# EAGLE schematic SMP (EAGLE 9.4.2)

## Sheet 1 of 5
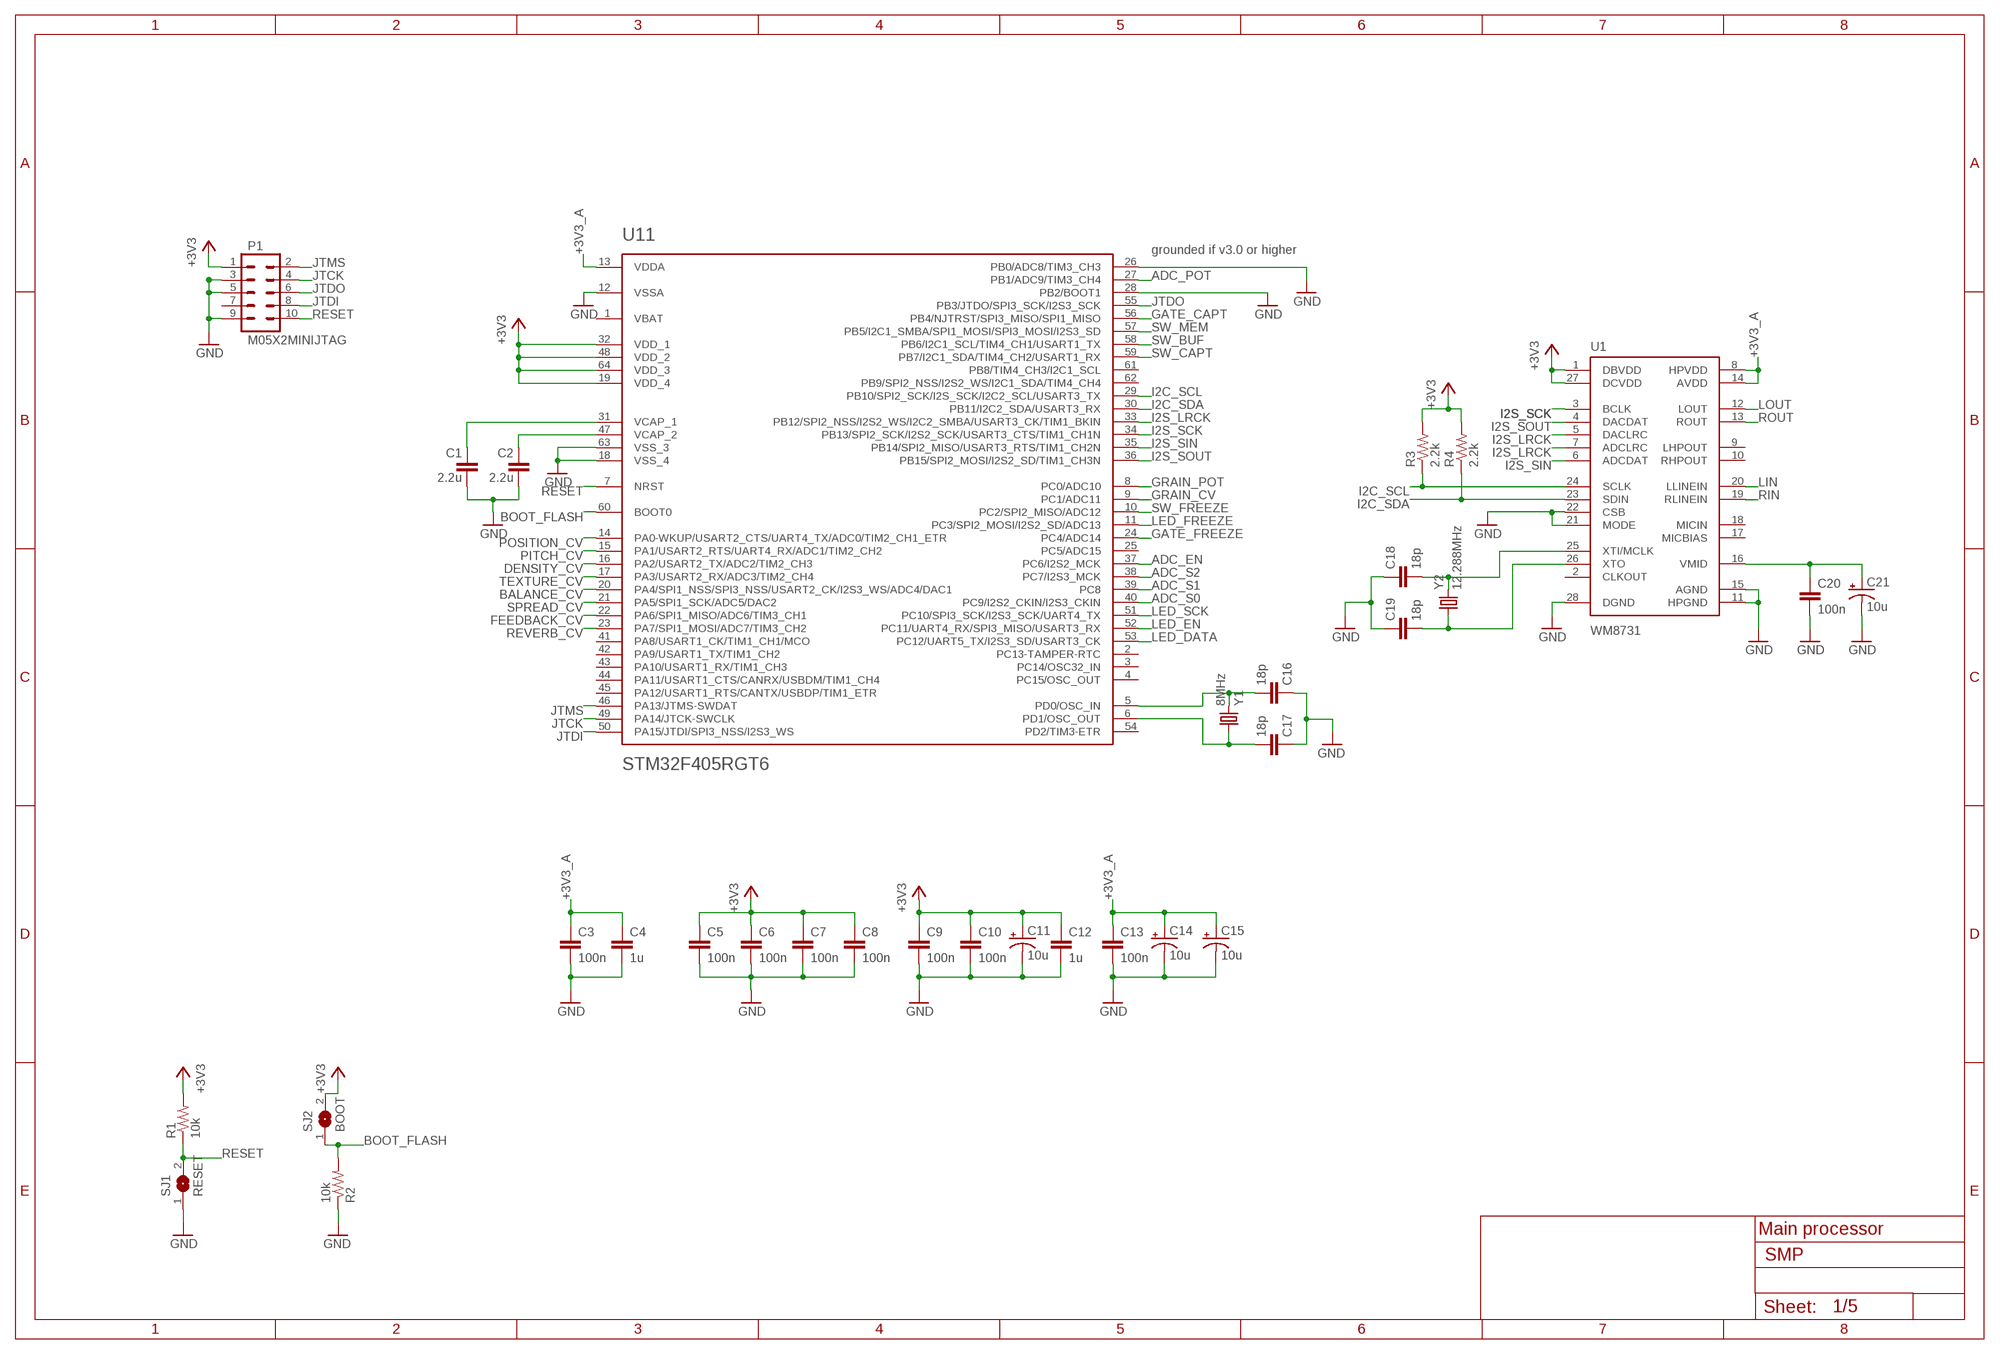
[diagram p0: schematic, sheet 1]

### Parts
C1  2.2u  C-EUC0603  [C0603]
C2  2.2u  C-EUC0603  [C0603]
C3  100n  C-EUC0603  [C0603]
C4  1u  C-EUC0603  [C0603]
C5  100n  C-EUC0603  [C0603]
C6  100n  C-EUC0603  [C0603]
C7  100n  C-EUC0603  [C0603]
C8  100n  C-EUC0603  [C0603]
C9  100n  C-EUC0603  [C0603]
C10  100n  C-EUC0603  [C0603]
C11  10u  CPOL-USA  [PANASONIC_A]
C12  1u  C-EUC0603  [C0603]
C13  100n  C-EUC0603  [C0603]
C14  10u  CPOL-USA  [PANASONIC_A]
C15  10u  CPOL-USB  [PANASONIC_B]
C16  18p  C-EUC0603  [C0603]
C17  18p  C-EUC0603  [C0603]
C18  18p  C-EUC0603  [C0603]
C19  18p  C-EUC0603  [C0603]
C20  100n  C-EUC0603  [C0603]
C21  10u  CPOL-USB  [PANASONIC_B]
P1  M05X2MINIJTAG  [2X5-1.27]
R1  10k  R-US_R0603  [R0603]
R2  10k  R-US_R0603  [R0603]
R3  2.2k  R-US_R0603  [R0603]
R4  2.2k  R-US_R0603  [R0603]
SJ1  RESET  SJ  [SJ]
SJ2  BOOT  SJ  [SJ]
U1  WM8731  [SSOP28]
U11  STM32F405RGT6  STM32F20X  [TQFP-10X10-64]
Y1  8MHz  CRYSTALHC49UP  [HC49UP]
Y2  12.288MHz  CRYSTALHC49UP  [HC49UP]

### Nets
+3V3 [width]: C5.1 C6.1 C7.1 C8.1 C9.1 C10.1 C11.+ C12.1 P1.1 R1.2 R3.2 R4.2 SJ2.2 U1.1(DBVDD) U1.27(DCVDD) U11.19(VDD_4) U11.32(VDD_1) U11.48(VDD_2) U11.64(VDD_3) ; also sheet 4,5
+3V3_A [width]: C3.1 C4.1 C13.1 C14.+ C15.+ U1.8(HPVDD) U1.14(AVDD) U11.13(VDDA) ; also sheet 3,4,5
ADC_EN: U11.37(PC6/I2S2_MCK) ; also sheet 4
ADC_POT: U11.27(PB1/ADC9/TIM3_CH4) ; also sheet 4
ADC_S0: U11.40(PC9/I2S2_CKIN/I2S3_CKIN) ; also sheet 4
ADC_S1: U11.39(PC8) ; also sheet 4
ADC_S2: U11.38(PC7/I2S3_MCK) ; also sheet 4
BALANCE_CV: U11.20(PA4/SPI1_NSS/SPI3_NSS/USART2_CK/I2S3_WS/ADC4/DAC1) ; also sheet 3
BOOT_FLASH: R2.2 SJ2.1 U11.60(BOOT0)
DENSITY_CV: U11.16(PA2/USART2_TX/ADC2/TIM2_CH3) ; also sheet 3
FEEDBACK_CV: U11.22(PA6/SPI1_MISO/ADC6/TIM3_CH1) ; also sheet 3
GATE_CAPT: U11.56(PB4/NJTRST/SPI3_MISO/SPI1_MISO) ; also sheet 4
GATE_FREEZE: U11.24(PC4/ADC14) ; also sheet 4
GND: C1.2 C2.2 C3.2 C4.2 C5.2 C6.2 C7.2 C8.2 C9.2 C10.2 C11.- C12.2 C13.2 C14.- C15.- C16.1 C17.1 C18.1 C19.1 C20.2 C21.- P1.3 P1.5 P1.9 R2.1 SJ1.1 U1.11(HPGND) U1.15(AGND) U1.21(MODE) U1.22(CSB) U1.28(DGND) U11.12(VSSA) U11.18(VSS_4) U11.26(PB0/ADC8/TIM3_CH3) U11.28(PB2/BOOT1) U11.63(VSS_3) ; also sheet 2,3,4,5
GRAIN_CV: U11.9(PC1/ADC11) ; also sheet 3
GRAIN_POT: U11.8(PC0/ADC10) ; also sheet 4
I2C_SCL: R3.1 U1.24(SCLK) U11.29(PB10/SPI2_SCK/I2S_SCK/I2C2_SCL/USART3_TX)
I2C_SDA: R4.1 U1.23(SDIN) U11.30(PB11/I2C2_SDA/USART3_RX)
I2S_LRCK: U1.5(DACLRC) U1.7(ADCLRC) U11.33(PB12/SPI2_NSS/I2S2_WS/I2C2_SMBA/USART3_CK/TIM1_BKIN)
I2S_SCK: U1.3(BCLK) U11.34(PB13/SPI2_SCK/I2S2_SCK/USART3_CTS/TIM1_CH1N)
I2S_SIN: U1.6(ADCDAT) U11.35(PB14/SPI2_MISO/USART3_RTS/TIM1_CH2N)
I2S_SOUT: U1.4(DACDAT) U11.36(PB15/SPI2_MOSI/I2S2_SD/TIM1_CH3N)
JTCK: P1.4 U11.49(PA14/JTCK-SWCLK)
JTDI: P1.8 U11.50(PA15/JTDI/SPI3_NSS/I2S3_WS)
JTDO: P1.6 U11.55(PB3/JTDO/SPI3_SCK/I2S3_SCK)
JTMS: P1.2 U11.46(PA13/JTMS-SWDAT)
LED_DATA: U11.53(PC12/UART5_TX/I2S3_SD/USART3_CK) ; also sheet 4
LED_EN: U11.52(PC11/UART4_RX/SPI3_MISO/USART3_RX) ; also sheet 4
LED_FREEZE: U11.11(PC3/SPI2_MOSI/I2S2_SD/ADC13) ; also sheet 4
LED_SCK: U11.51(PC10/SPI3_SCK/I2S3_SCK/UART4_TX) ; also sheet 4
LIN: U1.20(LLINEIN) ; also sheet 2
LOUT: U1.12(LOUT) ; also sheet 2
N$7: C16.2 U11.5(PD0/OSC_IN) Y1.2
N$8: C17.2 U11.6(PD1/OSC_OUT) Y1.1
N$13: C2.1 U11.47(VCAP_2)
N$17: C20.1 C21.+ U1.16(VMID)
N$19: C1.1 U11.31(VCAP_1)
N$59: C19.2 U1.26(XTO) Y2.1
N$60: C18.2 U1.25(XTI/MCLK) Y2.2
PITCH_CV: U11.15(PA1/USART2_RTS/UART4_RX/ADC1/TIM2_CH2) ; also sheet 3
POSITION_CV: U11.14(PA0-WKUP/USART2_CTS/UART4_TX/ADC0/TIM2_CH1_ETR) ; also sheet 3
RESET: P1.10 R1.1 SJ1.2 U11.7(NRST)
REVERB_CV: U11.23(PA7/SPI1_MOSI/ADC7/TIM3_CH2) ; also sheet 3
RIN: U1.19(RLINEIN) ; also sheet 2
ROUT: U1.13(ROUT) ; also sheet 2
SPREAD_CV: U11.21(PA5/SPI1_SCK/ADC5/DAC2) ; also sheet 3
SW_BUF: U11.58(PB6/I2C1_SCL/TIM4_CH1/USART1_TX) ; also sheet 4
SW_CAPT: U11.59(PB7/I2C1_SDA/TIM4_CH2/USART1_RX) ; also sheet 4
SW_FREEZE: U11.10(PC2/SPI2_MISO/ADC12) ; also sheet 4
SW_MEM: U11.57(PB5/I2C1_SMBA/SPI1_MOSI/SPI3_MOSI/I2S3_SD) ; also sheet 4
TEXTURE_CV: U11.17(PA3/USART2_RX/ADC3/TIM2_CH4) ; also sheet 3
Unconnected: P1.7 U1.2(CLKOUT) U1.9(LHPOUT) U1.10(RHPOUT) U1.17(MICBIAS) U1.18(MICIN) U11.2(PC13-TAMPER-RTC) U11.3(PC14/OSC32_IN) U11.4(PC15/OSC_OUT) U11.25(PC5/ADC15) U11.41(PA8/USART1_CK/TIM1_CH1/MCO) U11.42(PA9/USART1_TX/TIM1_CH2) U11.43(PA10/USART1_RX/TIM1_CH3) U11.44(PA11/USART1_CTS/CANRX/USBDM/TIM1_CH4) U11.45(PA12/USART1_RTS/CANTX/USBDP/TIM1_ETR) U11.54(PD2/TIM3-ETR) U11.61(PB8/TIM4_CH3/I2C1_SCL) U11.62(PB9/SPI2_NSS/I2S2_WS/I2C1_SDA/TIM4_CH4)

### Notes on the sheet
- grounded if v3.0 or higher
- Main processor

## Sheet 2 of 5
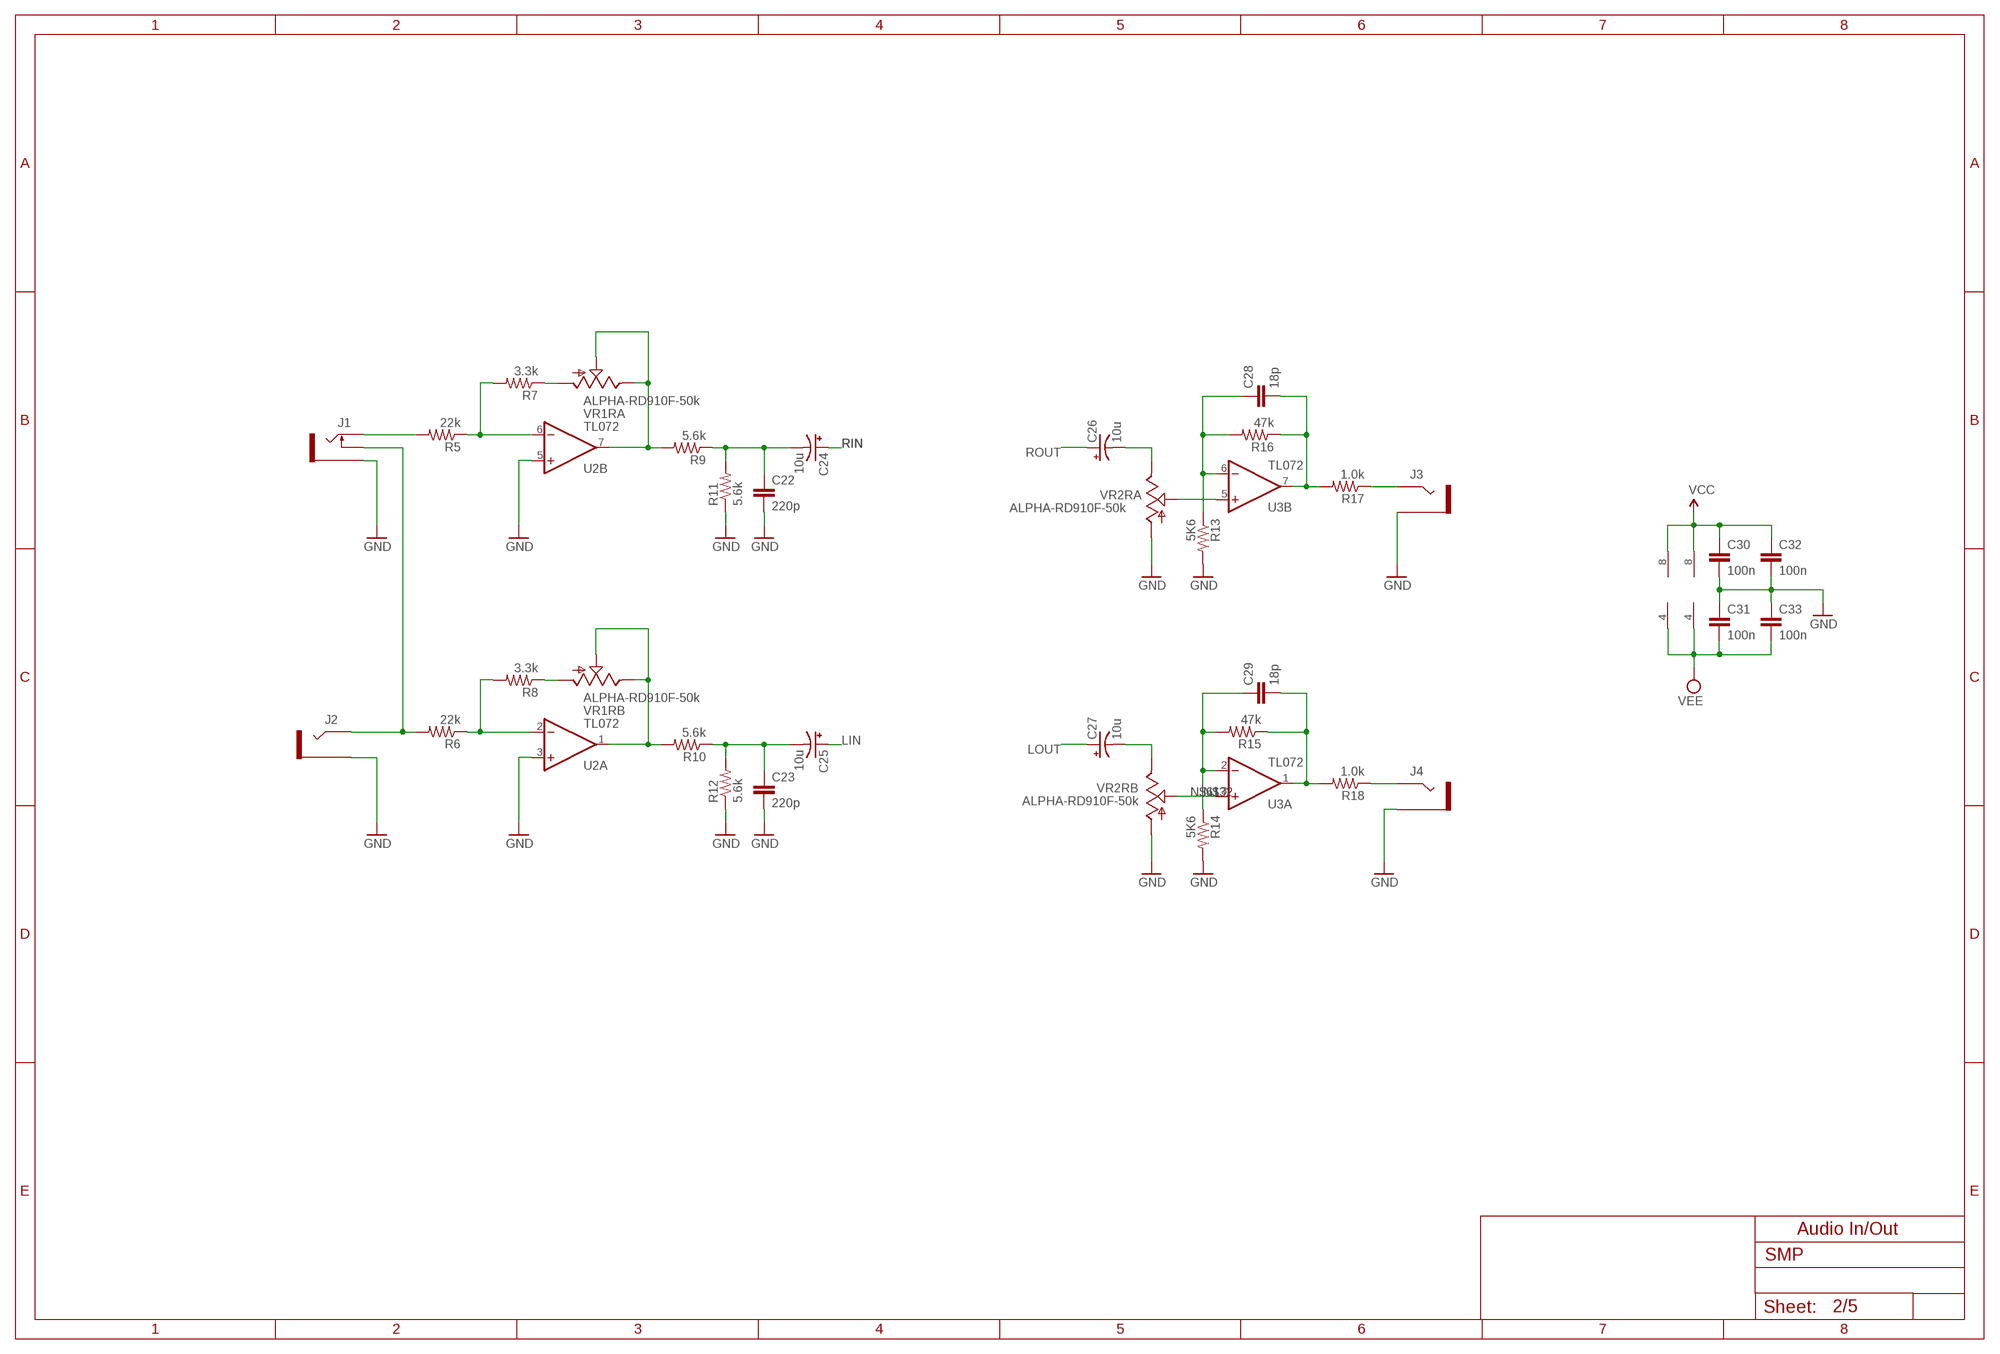
[diagram p1: schematic, sheet 2]

### Parts
C22  220p  C-EUC0603  [C0603]
C23  220p  C-EUC0603  [C0603]
C24  10u  CPOL-USB  [PANASONIC_B]
C25  10u  CPOL-USB  [PANASONIC_B]
C26  10u  CPOL-USB  [PANASONIC_B]
C27  10u  CPOL-USB  [PANASONIC_B]
C28  18p  C-EUC0603  [C0603]
C29  18p  C-EUC0603  [C0603]
C30  100n  C-EUC0603  [C0603]
C31  100n  C-EUC0603  [C0603]
C32  100n  C-EUC0603  [C0603]
C33  100n  C-EUC0603  [C0603]
J1  SWITCHCRAFT_42A  [SWITCH_JOHNSON]
J2  SWITCHCRAFT_JACK  [SWITCH]
J3  SWITCHCRAFT_JACK  [SWITCH]
J4  SWITCHCRAFT_JACK  [SWITCH]
R5  22k  R-US_R0603  [R0603]
R6  22k  R-US_R0603  [R0603]
R7  3.3k  R-US_R0603  [R0603]
R8  3.3k  R-US_R0603  [R0603]
R9  5.6k  R-US_R0603  [R0603]
R10  5.6k  R-US_R0603  [R0603]
R11  5.6k  R-US_R0603  [R0603]
R12  5.6k  R-US_R0603  [R0603]
R13  5K6  R-US_R0603  [R0603]
R14  5K6  R-US_R0603  [R0603]
R15  47k  R-US_R0603  [R0603]
R16  47k  R-US_R0603  [R0603]
R17  1.0k  R-US_R0603  [R0603]
R18  1.0k  R-US_R0603  [R0603]
U2  TL072  DUAL_OPAMPD  [SO08]
U3  TL072  DUAL_OPAMPD  [SO08]
VR1  ALPHA-RD910F-50k  POT_US_DUAL_GANGALPHA  [ALPHA902F]
VR2  ALPHA-RD910F-50k  POT_US_DUAL_GANGALPHA  [ALPHA902F]

### Nets
GND: C22.2 C23.2 C30.2 C31.1 C32.2 C33.1 J1.G J2.G J3.G J4.G R11.1 R12.1 R13.2 R14.2 U2.3(A:+IN) U2.5(B:+IN) VR2.1R1 VR2.1R2 ; also sheet 1,3,4,5
LIN: C25.+ ; also sheet 1
LOUT: C27.+ ; also sheet 1
LOUT_JACK: J4.S R18.1
N$3: C26.- VR2.3R1
N$18: C23.1 C25.- R10.1 R12.2
N$20: J1.S R5.2
N$21: J1.C J2.S R6.2
N$22: C22.1 C24.- R9.1 R11.2
N$23: C27.- VR2.3R2
N$25: C28.1 R13.1 R16.2 U3.6(B:-IN)
N$28: C28.2 R16.1 R17.2 U3.7(B:OUT)
N$31: U3.5(B:+IN) VR2.2R1
N$32: C29.1 R14.1 R15.2 U3.2(A:-IN)
N$33: C29.2 R15.1 R18.2 U3.1(A:OUT)
N$42: R9.2 U2.7(B:OUT) VR1.2R1 VR1.3R1
N$51: R10.2 U2.1(A:OUT) VR1.2R2 VR1.3R2
N$52: R7.1 VR1.1R1
N$53: R8.1 VR1.1R2
N$54: R5.1 R7.2 U2.6(B:-IN)
N$58: R6.1 R8.2 U2.2(A:-IN)
N$61: U3.3(A:+IN) VR2.2R2
RIN: C24.+ ; also sheet 1
ROUT: C26.+ ; also sheet 1
ROUT_JACK: J3.S R17.1
VCC [width]: C30.1 C32.1 U2.8(P:V+) U3.8(P:V+) ; also sheet 3,5
VEE [width]: C31.2 C33.2 U2.4(P:V-) U3.4(P:V-) ; also sheet 3,5

### Notes on the sheet
- Audio In/Out

## Sheet 3 of 5
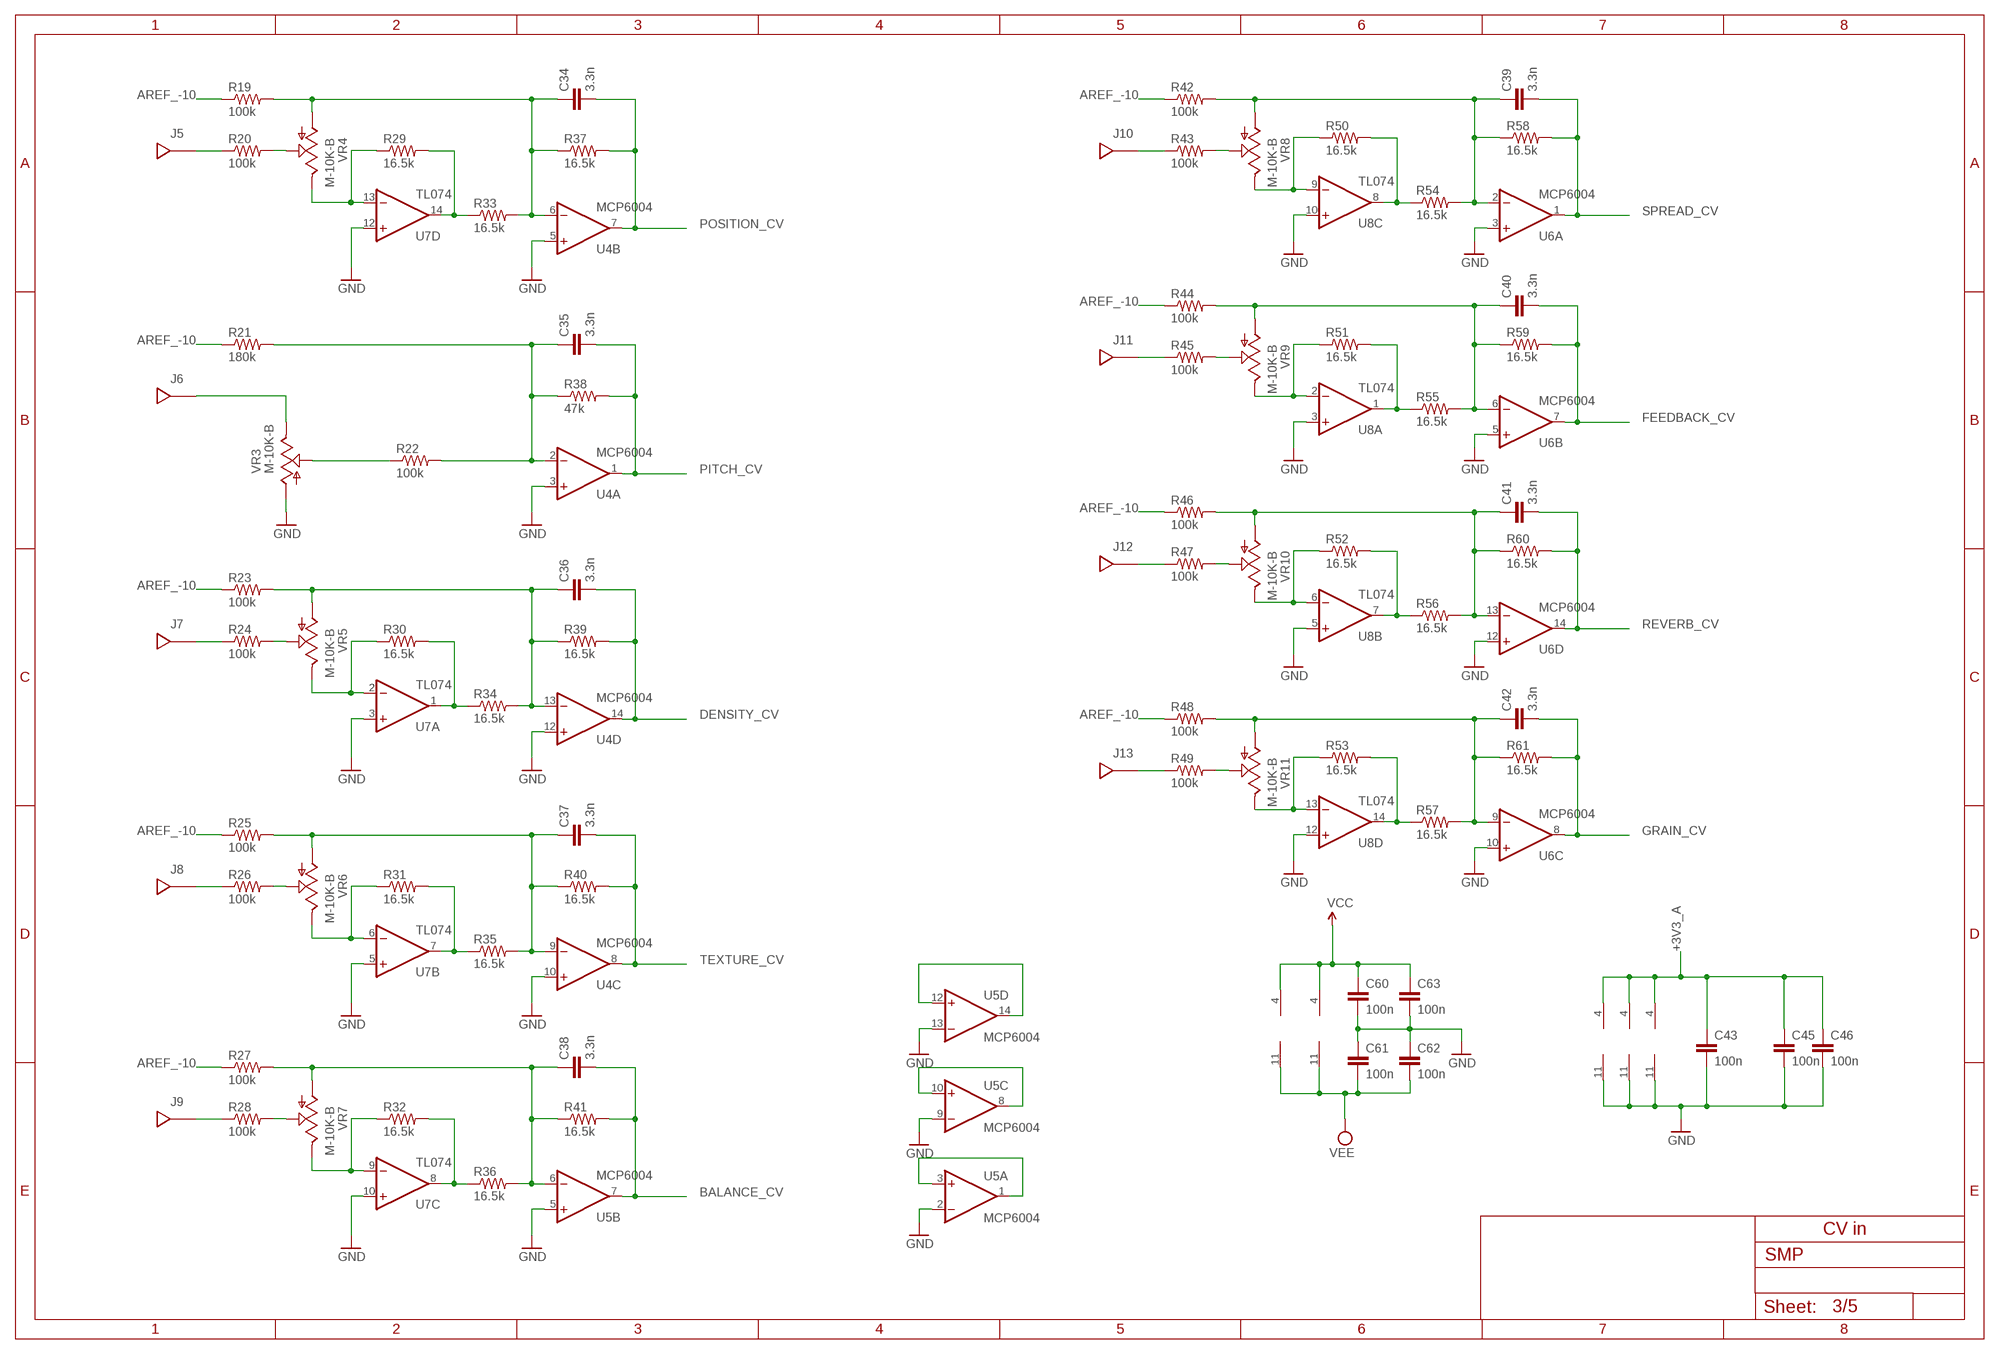
[diagram p2: schematic, sheet 3]

### Parts
C34  3.3n  C-EUC0603  [C0603]
C35  3.3n  C-EUC0603  [C0603]
C36  3.3n  C-EUC0603  [C0603]
C37  3.3n  C-EUC0603  [C0603]
C38  3.3n  C-EUC0603  [C0603]
C39  3.3n  C-EUC0603  [C0603]
C40  3.3n  C-EUC0603  [C0603]
C41  3.3n  C-EUC0603  [C0603]
C42  3.3n  C-EUC0603  [C0603]
C43  100n  C-EUC0603  [C0603]
C45  100n  C-EUC0603  [C0603]
C46  100n  C-EUC0603  [C0603]
C60  100n  C-EUC0603  [C0603]
C61  100n  C-EUC0603  [C0603]
C62  100n  C-EUC0603  [C0603]
C63  100n  C-EUC0603  [C0603]
J5  JOHNSON_BANANASTD  [JOHNSON]
J6  JOHNSON_BANANASTD  [JOHNSON]
J7  JOHNSON_BANANASTD  [JOHNSON]
J8  JOHNSON_BANANASTD  [JOHNSON]
J9  JOHNSON_BANANASTD  [JOHNSON]
J10  JOHNSON_BANANASTD  [JOHNSON]
J11  JOHNSON_BANANASTD  [JOHNSON]
J12  JOHNSON_BANANASTD  [JOHNSON]
J13  JOHNSON_BANANASTD  [JOHNSON]
R19  100k  R-US_R0603  [R0603]
R20  100k  R-US_R0603  [R0603]
R21  180k  R-US_R0603  [R0603]
R22  100k  R-US_R0603  [R0603]
R23  100k  R-US_R0603  [R0603]
R24  100k  R-US_R0603  [R0603]
R25  100k  R-US_R0603  [R0603]
R26  100k  R-US_R0603  [R0603]
R27  100k  R-US_R0603  [R0603]
R28  100k  R-US_R0603  [R0603]
R29  16.5k  R-US_R0603  [R0603]
R30  16.5k  R-US_R0603  [R0603]
R31  16.5k  R-US_R0603  [R0603]
R32  16.5k  R-US_R0603  [R0603]
R33  16.5k  R-US_R0603  [R0603]
R34  16.5k  R-US_R0603  [R0603]
R35  16.5k  R-US_R0603  [R0603]
R36  16.5k  R-US_R0603  [R0603]
R37  16.5k  R-US_R0603  [R0603]
R38  47k  R-US_R0603  [R0603]
R39  16.5k  R-US_R0603  [R0603]
R40  16.5k  R-US_R0603  [R0603]
R41  16.5k  R-US_R0603  [R0603]
R42  100k  R-US_R0603  [R0603]
R43  100k  R-US_R0603  [R0603]
R44  100k  R-US_R0603  [R0603]
R45  100k  R-US_R0603  [R0603]
R46  100k  R-US_R0603  [R0603]
R47  100k  R-US_R0603  [R0603]
R48  100k  R-US_R0603  [R0603]
R49  100k  R-US_R0603  [R0603]
R50  16.5k  R-US_R0603  [R0603]
R51  16.5k  R-US_R0603  [R0603]
R52  16.5k  R-US_R0603  [R0603]
R53  16.5k  R-US_R0603  [R0603]
R54  16.5k  R-US_R0603  [R0603]
R55  16.5k  R-US_R0603  [R0603]
R56  16.5k  R-US_R0603  [R0603]
R57  16.5k  R-US_R0603  [R0603]
R58  16.5k  R-US_R0603  [R0603]
R59  16.5k  R-US_R0603  [R0603]
R60  16.5k  R-US_R0603  [R0603]
R61  16.5k  R-US_R0603  [R0603]
U4  MCP6004  QUAD_OPAMPD  [SO14]
U5  MCP6004  QUAD_OPAMPD  [SO14]
U6  MCP6004  QUAD_OPAMPD  [SO14]
U7  TL074  QUAD_OPAMPD  [SO14]
U8  TL074  QUAD_OPAMPD  [SO14]
VR3  M-10K-B  POT_USRD901F  [ALPHA901F]
VR4  M-10K-B  POT_USRD901F  [ALPHA901F]
VR5  M-10K-B  POT_USRD901F  [ALPHA901F]
VR6  M-10K-B  POT_USRD901F  [ALPHA901F]
VR7  M-10K-B  POT_USRD901F  [ALPHA901F]
VR8  M-10K-B  POT_USRD901F  [ALPHA901F]
VR9  M-10K-B  POT_USRD901F  [ALPHA901F]
VR10  M-10K-B  POT_USRD901F  [ALPHA901F]
VR11  M-10K-B  POT_USRD901F  [ALPHA901F]

### Nets
+3V3_A [width]: C43.1 C45.1 C46.1 U4.4(P:V+) U5.4(P:V+) U6.4(P:V+) ; also sheet 1,4,5
AREF_-10 [width]: R19.1 R21.1 R23.1 R25.1 R27.1 R42.1 R44.1 R46.1 R48.1 ; also sheet 5
BALANCE_CV: C38.2 R41.2 U5.7(B:OUT) ; also sheet 1
DENSITY_CV: C36.2 R39.2 U4.14(D:OUT) ; also sheet 1
FEEDBACK_CV: C40.2 R59.2 U6.7(B:OUT) ; also sheet 1
GND: C43.2 C45.2 C46.2 C60.2 C61.1 C62.1 C63.2 U4.3(A:+IN) U4.5(B:+IN) U4.10(C:+IN) U4.11(P:V-) U4.12(D:+IN) U5.2(A:-IN) U5.5(B:+IN) U5.9(C:-IN) U5.11(P:V-) U5.13(D:-IN) U6.3(A:+IN) U6.5(B:+IN) U6.10(C:+IN) U6.11(P:V-) U6.12(D:+IN) U7.3(A:+IN) U7.5(B:+IN) U7.10(C:+IN) U7.12(D:+IN) U8.3(A:+IN) U8.5(B:+IN) U8.10(C:+IN) U8.12(D:+IN) VR3.1 ; also sheet 1,2,4,5
GRAIN_CV: C42.2 R61.2 U6.8(C:OUT) ; also sheet 1
N$1: J7.1 R24.1
N$2: R43.2 VR8.2
N$4: C36.1 R23.2 R34.2 R39.1 U4.13(D:-IN) VR5.1
N$5: R30.1 U7.2(A:-IN) VR5.3
N$6: R30.2 R34.1 U7.1(A:OUT)
N$10: J8.1 R26.1
N$11: R47.2 VR10.2
N$14: C37.1 R25.2 R35.2 R40.1 U4.9(C:-IN) VR6.1
N$15: R31.1 U7.6(B:-IN) VR6.3
N$24: R31.2 R35.1 U7.7(B:OUT)
N$26: J9.1 R28.1
N$27: R49.2 VR11.2
N$30: C38.1 R27.2 R36.2 R41.1 U5.6(B:-IN) VR7.1
N$35: R32.1 U7.9(C:-IN) VR7.3
N$56 [width]: J6.1 VR3.3
N$62: R32.2 R36.1 U7.8(C:OUT)
N$63: J5.1 R20.1
N$64: J10.1 R43.1
N$73: R28.2 VR7.2
N$81: U5.12(D:+IN) U5.14(D:OUT)
N$82: C34.1 R19.2 R33.2 R37.1 U4.6(B:-IN) VR4.1
N$83: R22.1 VR3.2
N$84: R29.1 U7.13(D:-IN) VR4.3
N$85: R29.2 R33.1 U7.14(D:OUT)
N$86: R26.2 VR6.2
N$87: C35.1 R21.2 R22.2 R38.1 U4.2(A:-IN)
N$90: J11.1 R45.1
N$91: R24.2 VR5.2
N$92: C39.1 R42.2 R54.2 R58.1 U6.2(A:-IN) VR8.1
N$93: R50.1 U8.9(C:-IN) VR8.3
N$94: R50.2 R54.1 U8.8(C:OUT)
N$95: J12.1 R47.1
N$96: R45.2 VR9.2
N$97: C40.1 R44.2 R55.2 R59.1 U6.6(B:-IN) VR9.1
N$98: R51.1 U8.2(A:-IN) VR9.3
N$99: R51.2 R55.1 U8.1(A:OUT)
N$101: U5.8(C:OUT) U5.10(C:+IN)
N$102: C41.1 R46.2 R56.2 R60.1 U6.13(D:-IN) VR10.1
N$103: R52.1 U8.6(B:-IN) VR10.3
N$104: R52.2 R56.1 U8.7(B:OUT)
N$105: J13.1 R49.1
N$106: R20.2 VR4.2
N$107: C42.1 R48.2 R57.2 R61.1 U6.9(C:-IN) VR11.1
N$108: R53.1 U8.13(D:-IN) VR11.3
N$109: R53.2 R57.1 U8.14(D:OUT)
N$111: U5.1(A:OUT) U5.3(A:+IN)
PITCH_CV: C35.2 R38.2 U4.1(A:OUT) ; also sheet 1
POSITION_CV: C34.2 R37.2 U4.7(B:OUT) ; also sheet 1
REVERB_CV: C41.2 R60.2 U6.14(D:OUT) ; also sheet 1
SPREAD_CV: C39.2 R58.2 U6.1(A:OUT) ; also sheet 1
TEXTURE_CV: C37.2 R40.2 U4.8(C:OUT) ; also sheet 1
VCC [width]: C60.1 C63.1 U7.4(P:V+) U8.4(P:V+) ; also sheet 2,5
VEE [width]: C61.2 C62.2 U7.11(P:V-) U8.11(P:V-) ; also sheet 2,5

### Notes on the sheet
- CV in

## Sheet 4 of 5
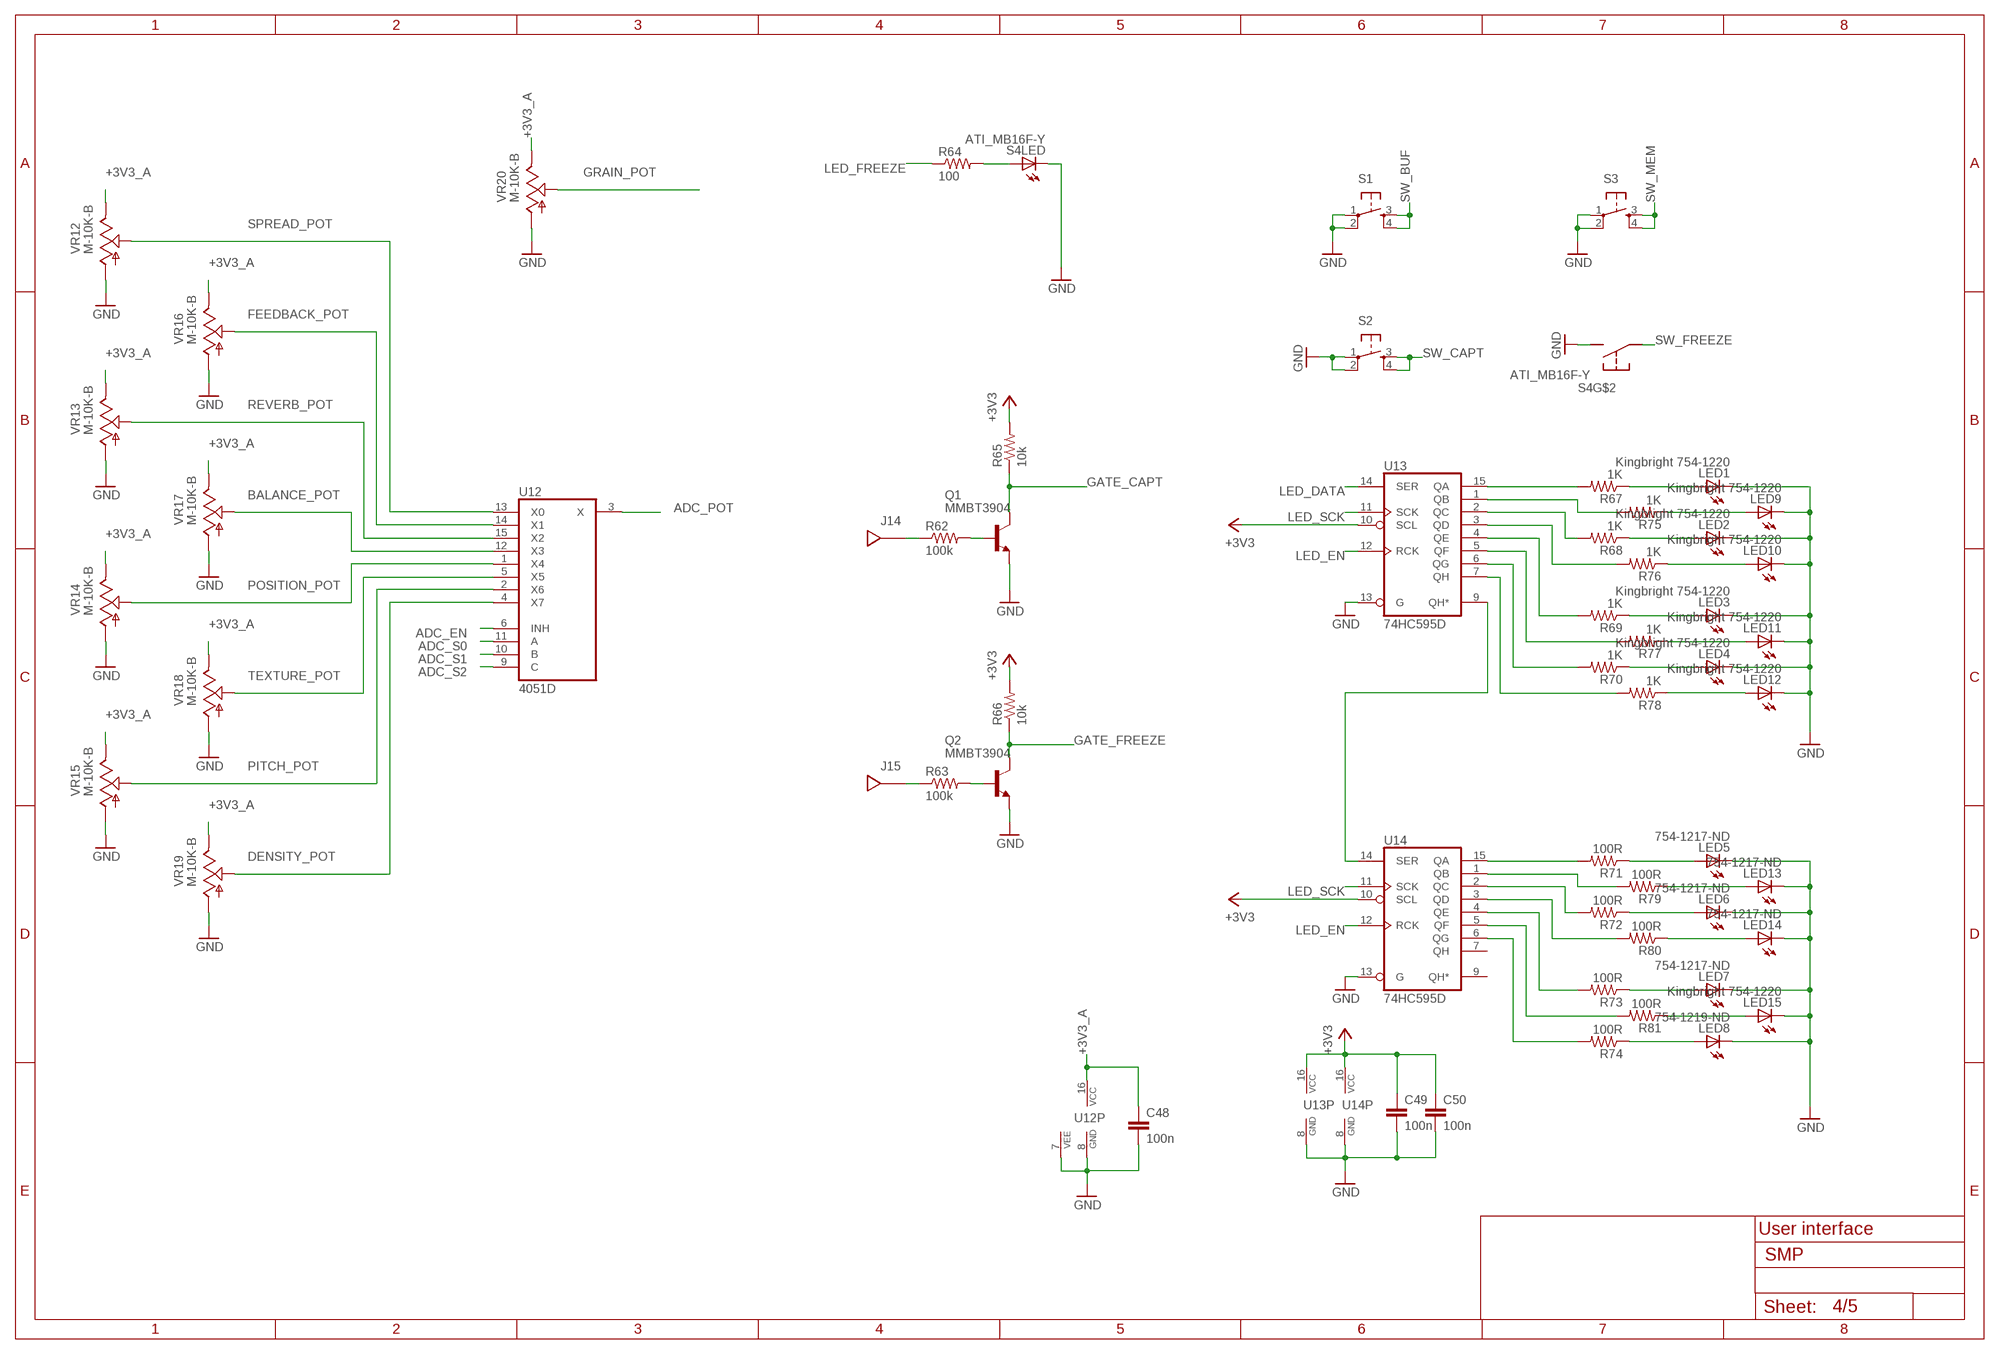
[diagram p3: schematic, sheet 4]

### Parts
C48  100n  C-EUC0603  [C0603]
C49  100n  C-EUC0603  [C0603]
C50  100n  C-EUC0603  [C0603]
J14  JOHNSON_BANANASTD  [JOHNSON]
J15  JOHNSON_BANANASTD  [JOHNSON]
LED1  Kingbright 754-1220  LED_3MM_MIN  [LED_3MM_MIN]
LED2  Kingbright 754-1220  LED_3MM_MIN  [LED_3MM_MIN]
LED3  Kingbright 754-1220  LED_3MM_MIN  [LED_3MM_MIN]
LED4  Kingbright 754-1220  LED_3MM_MIN  [LED_3MM_MIN]
LED5  754-1217-ND  LED_3MM_MIN  [LED_3MM_MIN]
LED6  754-1217-ND  LED_3MM_MIN  [LED_3MM_MIN]
LED7  754-1217-ND  LED_3MM_MIN  [LED_3MM_MIN]
LED8  754-1219-ND  LED_3MM_MIN  [LED_3MM_MIN]
LED9  Kingbright 754-1220  LED_3MM_MIN  [LED_3MM_MIN]
LED10  Kingbright 754-1220  LED_3MM_MIN  [LED_3MM_MIN]
LED11  Kingbright 754-1220  LED_3MM_MIN  [LED_3MM_MIN]
LED12  Kingbright 754-1220  LED_3MM_MIN  [LED_3MM_MIN]
LED13  754-1217-ND  LED_3MM_MIN  [LED_3MM_MIN]
LED14  754-1217-ND  LED_3MM_MIN  [LED_3MM_MIN]
LED15  Kingbright 754-1220  LED_3MM_MIN  [LED_3MM_MIN]
Q1  MMBT3904  MMBT3904LT1-NPN-SOT23-BEC  [SOT23-BEC]
Q2  MMBT3904  MMBT3904LT1-NPN-SOT23-BEC  [SOT23-BEC]
R62  100k  R-US_R0603  [R0603]
R63  100k  R-US_R0603  [R0603]
R64  100  R-US_R0603  [R0603]
R65  10k  R-US_R0603  [R0603]
R66  10k  R-US_R0603  [R0603]
R67  1K  R-US_R0603  [R0603]
R68  1K  R-US_R0603  [R0603]
R69  1K  R-US_R0603  [R0603]
R70  1K  R-US_R0603  [R0603]
R71  100R  R-US_R0603  [R0603]
R72  100R  R-US_R0603  [R0603]
R73  100R  R-US_R0603  [R0603]
R74  100R  R-US_R0603  [R0603]
R75  1K  R-US_R0603  [R0603]
R76  1K  R-US_R0603  [R0603]
R77  1K  R-US_R0603  [R0603]
R78  1K  R-US_R0603  [R0603]
R79  100R  R-US_R0603  [R0603]
R80  100R  R-US_R0603  [R0603]
R81  100R  R-US_R0603  [R0603]
S1  TAC_SWITCH  [C&K_D6R]
S2  TAC_SWITCH  [C&K_D6R]
S3  TAC_SWITCH  [C&K_D6R]
S4  ATI_MB16F-Y  [MB16F]
U12  4051D  [SO16]
U13  74HC595D  [SO16]
U14  74HC595D  [SO16]
VR12  M-10K-B  POT_USRD901F  [ALPHA901F]
VR13  M-10K-B  POT_USRD901F  [ALPHA901F]
VR14  M-10K-B  POT_USRD901F  [ALPHA901F]
VR15  M-10K-B  POT_USRD901F  [ALPHA901F]
VR16  M-10K-B  POT_USRD901F  [ALPHA901F]
VR17  M-10K-B  POT_USRD901F  [ALPHA901F]
VR18  M-10K-B  POT_USRD901F  [ALPHA901F]
VR19  M-10K-B  POT_USRD901F  [ALPHA901F]
VR20  M-10K-B  POT_USRD901F  [ALPHA901F]

### Nets
+3V3 [width]: C49.1 C50.1 R65.2 R66.2 U13.10(SCL) U13.16(VCC) U14.10(SCL) U14.16(VCC) ; also sheet 1,5
+3V3_A [width]: C48.1 U12.16(VCC) VR12.3 VR13.3 VR14.3 VR15.3 VR16.3 VR17.3 VR18.3 VR19.3 VR20.3 ; also sheet 1,3,5
ADC_EN: U12.6(INH) ; also sheet 1
ADC_POT: U12.3(X) ; also sheet 1
ADC_S0: U12.11(A) ; also sheet 1
ADC_S1: U12.10(B) ; also sheet 1
ADC_S2: U12.9(C) ; also sheet 1
BALANCE_POT: U12.12(X3) VR17.2
DENSITY_POT: U12.4(X7) VR19.2
FEEDBACK_POT: U12.14(X1) VR16.2
GATE_CAPT: Q1.C R65.1 ; also sheet 1
GATE_FREEZE: Q2.C R66.1 ; also sheet 1
GND: C48.2 C49.2 C50.2 LED1.K(C) LED2.K(C) LED3.K(C) LED4.K(C) LED5.K(C) LED6.K(C) LED7.K(C) LED8.K(C) LED9.K(C) LED10.K(C) LED11.K(C) LED12.K(C) LED13.K(C) LED14.K(C) LED15.K(C) Q1.E Q2.E S1.1 S1.2 S2.1 S2.2 S3.1 S3.2 S4.1 S4.4(LED:L2) U12.7(VEE) U12.8(GND) U13.8(GND) U13.13(G) U14.8(GND) U14.13(G) VR12.1 VR13.1 VR14.1 VR15.1 VR16.1 VR17.1 VR18.1 VR19.1 VR20.1 ; also sheet 1,2,3,5
GRAIN_POT: VR20.2 ; also sheet 1
LED_DATA: U13.14(SER) ; also sheet 1
LED_EN: U13.12(RCK) U14.12(RCK) ; also sheet 1
LED_FREEZE: R64.1 ; also sheet 1
LED_SCK: U13.11(SCK) U14.11(SCK) ; also sheet 1
N$9: LED9.A R75.1
N$12: LED1.A R67.1
N$16: LED2.A R68.1
N$29: LED10.A R76.1
N$34: LED3.A R69.1
N$36: J15.1 R63.1
N$37: Q2.B R63.2
N$38: R64.2 S4.3(LED:L1)
N$39: LED11.A R77.1
N$40: LED4.A R70.1
N$41: LED12.A R78.1
N$43: R67.2 U13.15(QA)
N$44: R75.2 U13.1(QB)
N$45: R68.2 U13.2(QC)
N$46: R76.2 U13.3(QD)
N$47: R69.2 U13.4(QE)
N$48: R77.2 U13.5(QF)
N$49: R70.2 U13.6(QG)
N$50: R78.2 U13.7(QH)
N$57: J14.1 R62.1
N$65: LED13.A R79.1
N$66: Q1.B R62.2
N$67: LED5.A R71.1
N$68: LED6.A R72.1
N$69: LED14.A R80.1
N$70: LED7.A R73.1
N$71: LED15.A R81.1
N$72: LED8.A R74.1
N$74: R71.2 U14.15(QA)
N$75: R79.2 U14.1(QB)
N$76: R72.2 U14.2(QC)
N$77: R80.2 U14.3(QD)
N$78: R73.2 U14.4(QE)
N$79: R81.2 U14.5(QF)
N$80: R74.2 U14.6(QG)
N$112: U13.9(QH*) U14.14(SER)
PITCH_POT: U12.2(X6) VR15.2
POSITION_POT: U12.1(X4) VR14.2
REVERB_POT: U12.15(X2) VR13.2
SPREAD_POT: U12.13(X0) VR12.2
SW_BUF: S1.3 S1.4 ; also sheet 1
SW_CAPT: S2.3 S2.4 ; also sheet 1
SW_FREEZE: S4.2 ; also sheet 1
SW_MEM: S3.3 S3.4 ; also sheet 1
TEXTURE_POT: U12.5(X5) VR18.2
Unconnected: U14.7(QH) U14.9(QH*)

### Notes on the sheet
- User interface

## Sheet 5 of 5
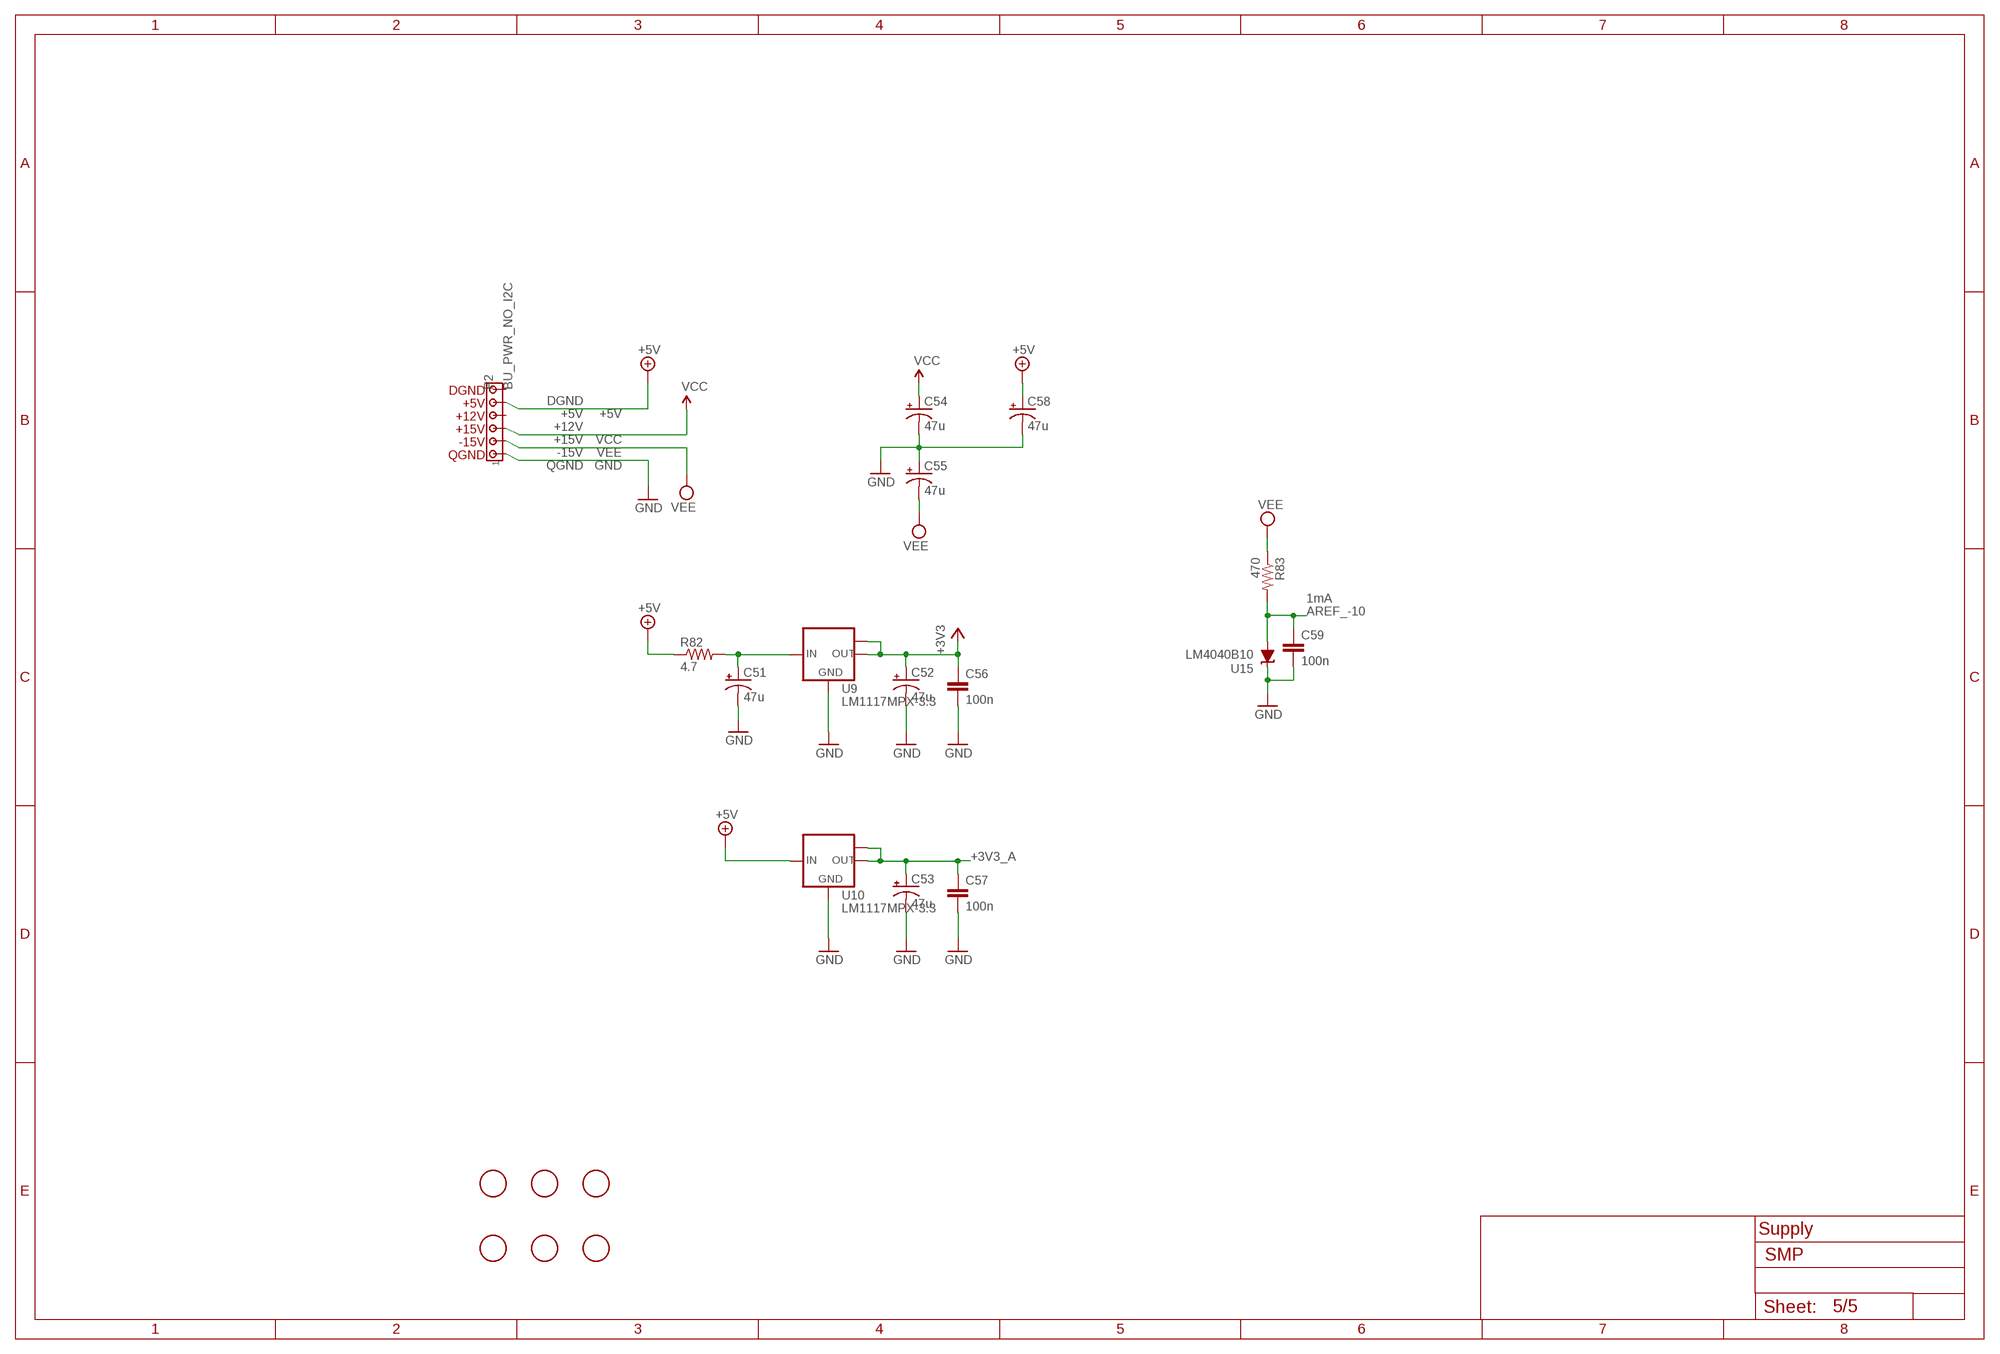
[diagram p4: schematic, sheet 5]

### Parts
C51  47u  CPOL-USD  [PANASONIC_D]
C52  47u  CPOL-USD  [PANASONIC_D]
C53  47u  CPOL-USD  [PANASONIC_D]
C54  47u  CPOL-USD  [PANASONIC_D]
C55  47u  CPOL-USD  [PANASONIC_D]
C56  100n  C-EUC0603  [C0603]
C57  100n  C-EUC0603  [C0603]
C58  47u  CPOL-USD  [PANASONIC_D]
C59  100n  C-EUC0603  [C0603]
FD1  FIDUCIAL  [FIDUCIAL_1MM]
FD2  FIDUCIAL  [FIDUCIAL_1MM]
FD3  FIDUCIAL  [FIDUCIAL_1MM]
FD4  FIDUCIAL  [FIDUCIAL_1MM]
FD5  FIDUCIAL  [FIDUCIAL_1MM]
FD6  FIDUCIAL  [FIDUCIAL_1MM]
P2  BU_PWR_NO_I2C  [MTA_156]
R82  4.7  R-US_R1206  [R1206]
R83  470  R-US_R0603  [R0603]
U9  LM1117MPX-3.3  [SOT223]
U10  LM1117MPX-3.3  [SOT223]
U15  LM4040B10  LM4041B12DBZ  [DBZ_R-PDSO-G3]

### Nets
+3V3 [width]: C52.+ C56.1 U9.2(OUT) U9.TAB(OUT1) ; also sheet 1,4
+3V3_A [width]: C53.+ C57.1 U10.2(OUT) U10.TAB(OUT1) ; also sheet 1,3,4
+5V: C58.+ P2.5 R82.1 U10.3(IN)
AREF_-10 [width]: C59.1 R83.2 U15.2(A) ; also sheet 3
GND: C51.- C52.- C53.- C54.- C55.+ C56.2 C57.2 C58.- C59.2 P2.1 U9.1(GND) U10.1(GND) U15.1(C) ; also sheet 1,2,3,4
N$55: C51.+ R82.2 U9.3(IN)
VCC [width]: C54.+ P2.3 ; also sheet 2,3
VEE [width]: C55.- P2.2 R83.1 ; also sheet 2,3
Unconnected: P2.4 P2.6

### Notes on the sheet
- DGND
- +5V
- +12V
- +15V
- -15V
- QGND
- 1mA
- Supply

## Power pins joined to a net without a drawn wire
VBAT: U11.1(VBAT)

## Library data of the parts
C1-C10 C12 C13 C16-C20 C22 C23 C28-C43 C45 C46 C48-C50 C56 C57 C59-C63 = ElectroSmith:C-EU: CAPACITOR, European symbol
C11 C14 C15 C21 C24-C27 C51-C55 C58 = rcl:CPOL-US: POLARIZED CAPACITOR, American symbol
FD1-FD6 = Electrosmith-Connectors:FIDUCIAL: For use by pick and place machines to calibrate the vision/machine, 1mm By microbuilder.eu
J1 = ElectroSmith:SWITCHCRAFT_42A
J2-J4 = og-pj301:SWITCHCRAFT_JACK
J5-J15 = og-pj301:JOHNSON_BANANA
LED1-LED15 = AndrewIkenberry:LED_3MM_MIN
P1 = og-header:M05X2: Header 5x2 Standard 10-pin dual row 0.1" header. Commonly used with AVR-ISP. Use with Spark Fun Electronics SKU: PRT-00778
P2 = Electrosmith-Connectors:BU_PWR_NO_I2C; 12V: +12V; 5V: +5V; DGND: DGND; PIN1_LABEL: 1; QGND: QGND; VCC: +15V; VEE: -15V
Q1 Q2 = transistor:*-NPN-: NPN Transistror BF959 corrected 2008.03.06
R1-R83 = AndrewIkenberry:R-US_: RESISTOR, American symbol
S1-S3 = SparkFun:TAC_SWITCH: Momentary Switch Button commonly used for reset or general input. Spark Fun Electronics SKU : COM-00097
S4 = ElectroSmith:ATI_MB16F-Y
SJ1 SJ2 = jumper:SJ: SMD solder JUMPER
U1 = og-dac:WM8731
U2 U3 = ElectroSmith:DUAL_OPAMP: OP AMP
U4-U8 = ElectroSmith:QUAD_OPAMP: OP AMP
U9 U10 = ElectroSmith:LM1117MPX-*
U11 = og-stm32f2:STM32F20X
U12 = og-ics:4051: 8-channel ANALOG MULTIPLEXER
U13 U14 = 74xx-eu:74*595: 8-bit SHIFT REGISTER, output latch
U15 = texas:LM4041: PRECISION MICROPOWER SHUNT VOLTAGE REFERENCE Source: http://focus.ti.com/lit/ds/slcs146e/slcs146e.pdf; MPN: LM4041B12IDBZR; OC_FARNELL: 1575212; OC_NEWARK: 58K5882
VR1 VR2 = ElectroSmith:POT_US_DUAL_GANG
VR3-VR20 = ElectroSmith:POT_US
Y1 Y2 = ElectroSmith:CRYSTAL: CRYSTAL; OC_FARNELL: unknown; OC_NEWARK: unknown

## Net classes
0 nets: width 0.203 mm, clearance 0.152 mm
1 width: width 0.152 mm, clearance 0.152 mm